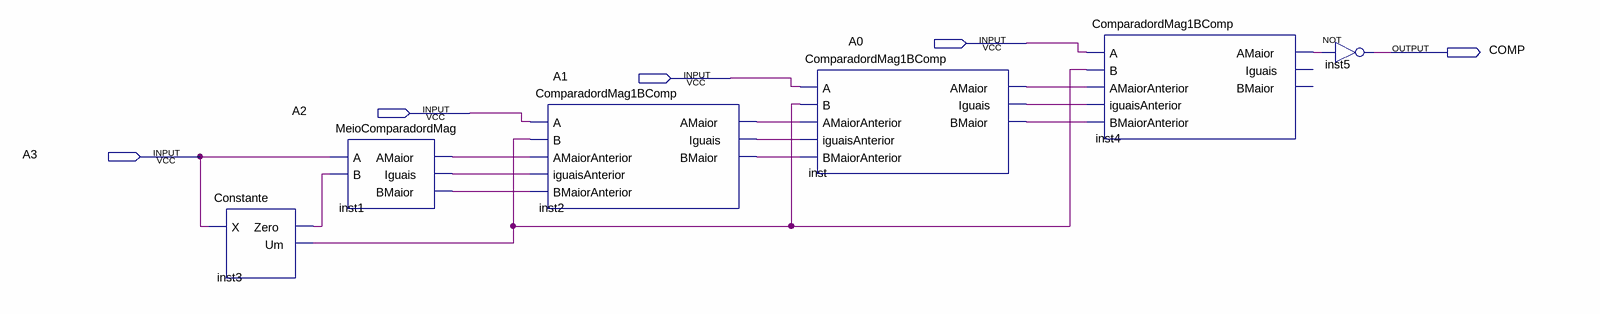
[diagram p0: schematic sheet]
// Quartus schematic ComparadordMag4B.bdf as structural Verilog: 6 symbols, 5 pins
module ComparadordMag4B (
  input  A0,
  input  A1,
  input  A2,
  input  A3,
  output COMP
);

  wire inst1_amaior, inst1_bmaior, inst1_iguais, inst2_amaior, inst2_bmaior, inst2_iguais, inst3_um,
       inst3_zero, inst4_amaior, inst_amaior, inst_bmaior, inst_iguais;

  Constante inst3 (.X(A3), .Zero(inst3_zero), .Um(inst3_um));
  MeioComparadordMag inst1 (
    .A(A3), .B(inst3_zero), .AMaior(inst1_amaior), .Iguais(inst1_iguais), .BMaior(inst1_bmaior));
  ComparadordMag1BComp inst2 (
    .A(A2), .B(inst3_um), .AMaiorAnterior(inst1_amaior), .iguaisAnterior(inst1_iguais),
    .BMaiorAnterior(inst1_bmaior), .AMaior(inst2_amaior), .Iguais(inst2_iguais), .BMaior(inst2_bmaior));
  ComparadordMag1BComp inst (
    .A(A1), .B(inst3_um), .AMaiorAnterior(inst2_amaior), .iguaisAnterior(inst2_iguais),
    .BMaiorAnterior(inst2_bmaior), .AMaior(inst_amaior), .Iguais(inst_iguais), .BMaior(inst_bmaior));
  ComparadordMag1BComp inst4 (
    .A(A0), .B(inst3_um), .AMaiorAnterior(inst_amaior), .iguaisAnterior(inst_iguais),
    .BMaiorAnterior(inst_bmaior), .AMaior(inst4_amaior));  // open: Iguais, BMaior
  not inst5 (COMP, inst4_amaior);
endmodule
